# Altium schematic sheet Jumpers High Low.SchDoc
size A; SheetNumber: 7; SheetTotal: 9
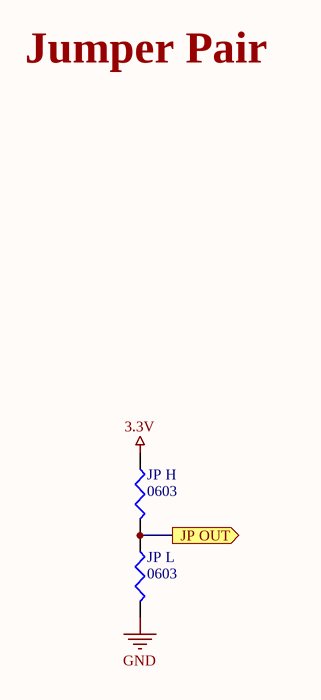
[diagram p0: Jumpers High Low.SchDoc]

## Parts
JP_H  0603  [J1-0603]
JP_L  0603  [J1-0603]

## Ports
JP OUT (out)

## Nets
3.3V: JP_H.1
GND: JP_L.2
JP OUT: JP_H.2 JP_L.1 ; port JP OUT

## Notes on the sheet
- Jumper Pair

## Library data of the parts
JP_H JP_L = Res3: Resistor; Published: 8-Jun-2000; LatestRevisionDate: 29-May-2009; LatestRevisionNote: IPC-7351 Footprint Added.; PackageReference: J1-0603; Publisher: Altium Limited; PackageDescription: Chip Resistor